# Altium project Speedometer_Tech.PrjPcb (part 2 of 2)

## Sheet 100_PowerSupply.SchDoc
size A3; SheetNumber: 11; SheetTotal: 12
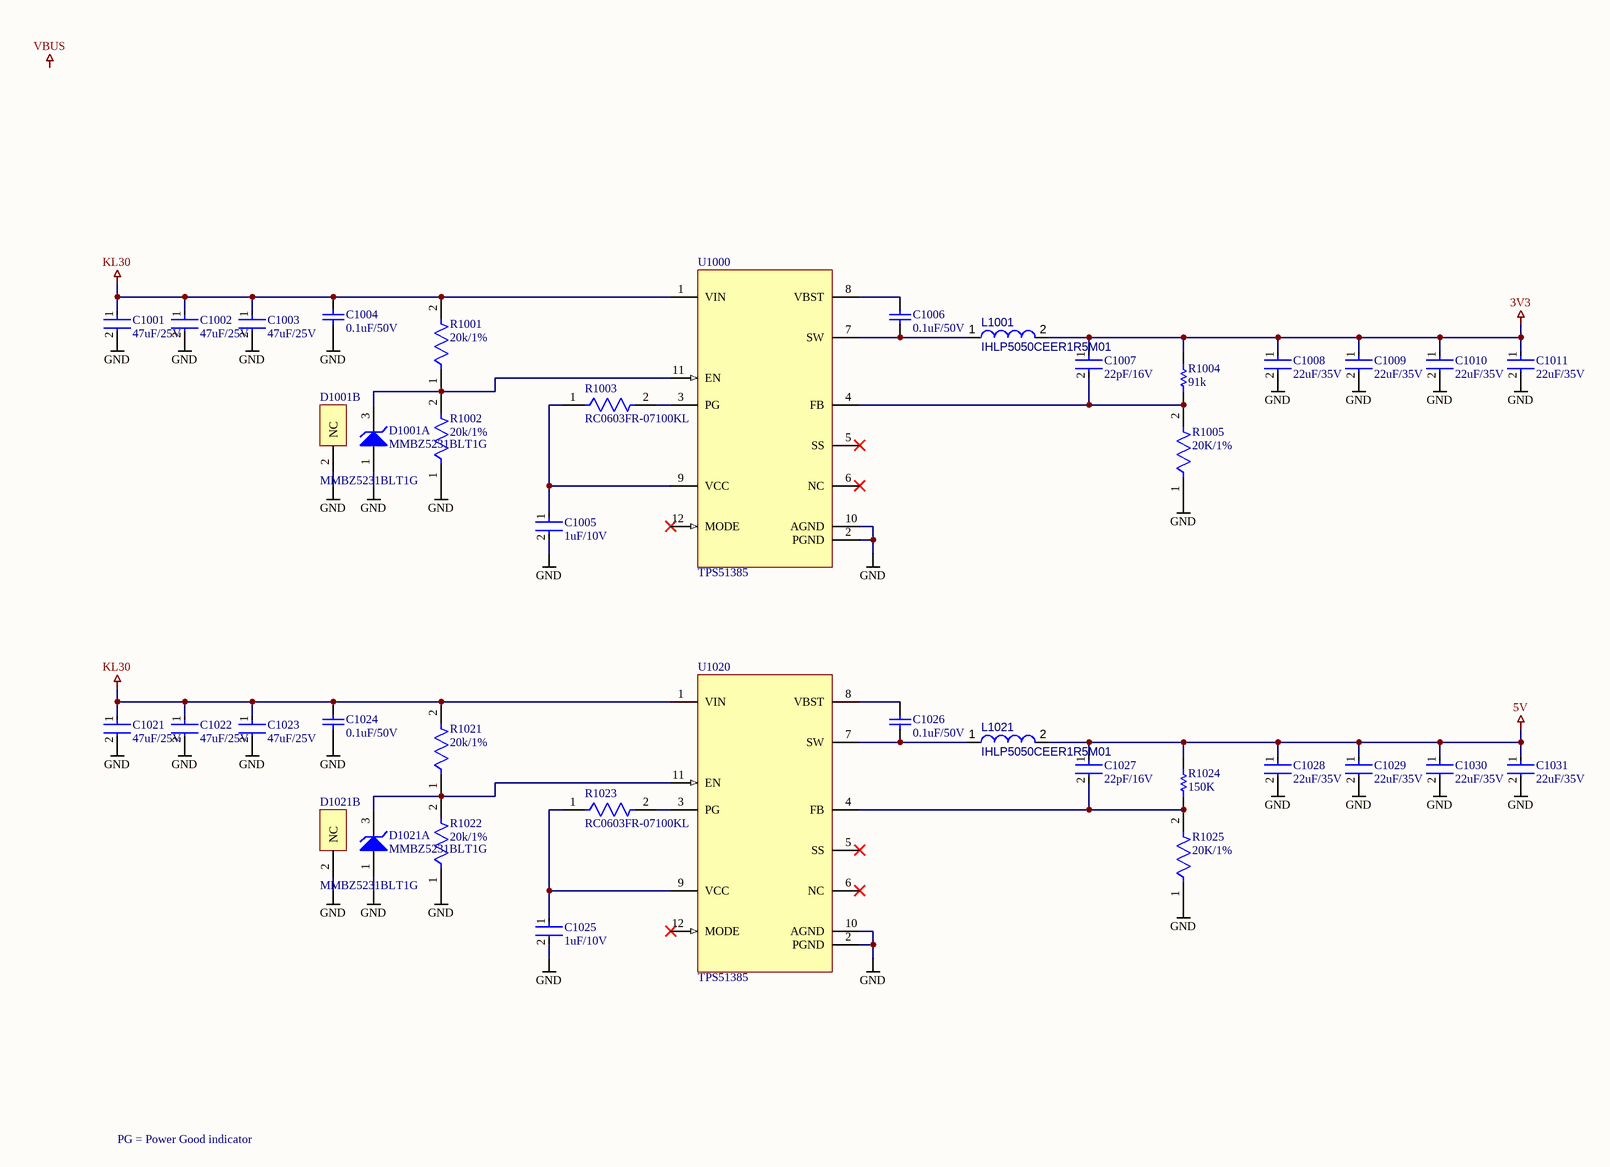
[diagram p10: 100_PowerSupply.SchDoc]

### Parts
C1001  47uF/25V  [FP-C3216-160-0_2-MFG]
C1002  47uF/25V  [FP-C3216-160-0_2-MFG]
C1003  47uF/25V  [FP-C3216-160-0_2-MFG]
C1004  0.1uF/50V  [CAPC2013X135X45ML10T25]
C1005  1uF/10V  [FP-C0603-CG-MFG]
C1006  0.1uF/50V  [CAPC2013X135X45ML10T25]
C1007  22pF/16V  [FP-C0603C-CF-MFG]
C1008  22uF/35V  [FP-C3216-160-0_2-IPC_B]
C1009  22uF/35V  [FP-C3216-160-0_2-IPC_B]
C1010  22uF/35V  [FP-C3216-160-0_2-IPC_B]
C1011  22uF/35V  [FP-C3216-160-0_2-IPC_B]
C1021  47uF/25V  [FP-C3216-160-0_2-MFG]
C1022  47uF/25V  [FP-C3216-160-0_2-MFG]
C1023  47uF/25V  [FP-C3216-160-0_2-MFG]
C1024  0.1uF/50V  [CAPC2013X135X45ML10T25]
C1025  1uF/10V  [FP-C0603-CG-MFG]
C1026  0.1uF/50V  [CAPC2013X135X45ML10T25]
C1027  22pF/16V  [FP-C0603C-CF-MFG]
C1028  22uF/35V  [FP-C3216-160-0_2-IPC_B]
C1029  22uF/35V  [FP-C3216-160-0_2-IPC_B]
C1030  22uF/35V  [FP-C3216-160-0_2-IPC_B]
C1031  22uF/35V  [FP-C3216-160-0_2-IPC_B]
D1001  MMBZ5231BLT1G  [ONSC-SOT-23-3-318-08_V]  (parts A,B of 2)
D1021  MMBZ5231BLT1G  [ONSC-SOT-23-3-318-08_V]  (parts A,B of 2)
L1001  IHLP5050CEER1R5M01  [IHLP5050CEER1R5M01]
L1021  IHLP5050CEER1R5M01  [IHLP5050CEER1R5M01]
R1001  20k/1%  [FP-RC0603-0_55-IPC_C]
R1002  20k/1%  [FP-RC0603-0_55-IPC_C]
R1003  RC0603FR-07100KL  [FP-RC0603-0_55-MFG]
R1004  91k  [RESC1609X50X30NL10T20]
R1005  20K/1%  [FP-RC0603-0_55-IPC_C]
R1021  20k/1%  [FP-RC0603-0_55-IPC_C]
R1022  20k/1%  [FP-RC0603-0_55-IPC_C]
R1023  RC0603FR-07100KL  [FP-RC0603-0_55-MFG]
R1024  150K  [RESC1608X55X30NL15T15]
R1025  20K/1%  [FP-RC0603-0_55-IPC_C]
U1000  TPS51385  [TPS51386]
U1020  TPS51385  [TPS51386]

### Nets
3V3: C1007.1 C1008.1 C1009.1 C1010.1 C1011.1 L1001.2 R1004.2
5V: C1027.1 C1028.1 C1029.1 C1030.1 C1031.1 L1021.2 R1024.2
GND: C1001.2 C1002.2 C1003.2 C1004.1 C1005.2 C1008.2 C1009.2 C1010.2 C1011.2 C1021.2 C1022.2 C1023.2 C1024.1 C1025.2 C1028.2 C1029.2 C1030.2 C1031.2 D1001.1(A) D1001.2(NC) D1021.1(A) D1021.2(NC) R1002.1 R1005.1 R1022.1 R1025.1 U1000.2(PGND) U1000.10(AGND) U1020.2(PGND) U1020.10(AGND)
KL30: C1001.1 C1002.1 C1003.1 C1004.2 C1021.1 C1022.1 C1023.1 C1024.2 R1001.2 R1021.2 U1000.1(VIN) U1020.1(VIN)
NetC1005_1: C1005.1 R1003.1 U1000.9(VCC)
NetC1006_1: C1006.1 L1001.1 U1000.7(SW)
NetC1006_2: C1006.2 U1000.8(VBST)
NetC1007_2: C1007.2 R1004.1 R1005.2 U1000.4(FB)
NetC1025_1: C1025.1 R1023.1 U1020.9(VCC)
NetC1026_1: C1026.1 L1021.1 U1020.7(SW)
NetC1026_2: C1026.2 U1020.8(VBST)
NetC1027_2: C1027.2 R1024.1 R1025.2 U1020.4(FB)
NetD1001_3: D1001.3(K) R1001.1 R1002.2 U1000.11(EN)
NetD1021_3: D1021.3(K) R1021.1 R1022.2 U1020.11(EN)
NetR1003_2: R1003.2 U1000.3(PG)
NetR1023_2: R1023.2 U1020.3(PG)

Not connected (* = marked no-connect by the designer): U1000 5(SS)* 6(NC)* 12(MODE)*; U1020 5(SS)* 6(NC)* 12(MODE)*

### Notes on the sheet
- PG = Power Good indicator
- Labels drawn without touching a wire or pin: VBUS

### Library data of the parts
C1001-C1003 C1021-C1023 = CMP-2000-05397-3: Multilayer Ceramic Capacitors 47uF ±20% 25V X5R SMD 1206 / C3216X5R1E476M160AC; Weight: 0.000571oz; Dielectric: X5R; Length: 0.126inch; Voltage Rating: 25V; Case/Package: 1206; Dielectric Material: Ceramic; Min Operating Temperature: -55°C; Lead Free: Lead Free; Packaging: Tape and Reel; Package Quantity: 1; Mount: Surface Mount; Depth: 1.6mm; REACH SVHC: No SVHC; Termination: SMD/SMT; Case Code (Imperial): 1206; Series: C; Resistor Type: Ceramic; Voltage: 25V; Width: 0.063inch; Height: 1.6mm; Tolerance: 20%; Capacitance: 47uF; Max Operating Temperature: 85°C; Voltage Rating (DC): 25V; RoHS Compliant: Yes; Thickness: 0.071inch; Case Code (Metric): 3216
C1004 C1006 C1024 C1026 = CMP-2100-03644-1: Chip Capacitor, 0.1 uF, +/- 10%, 50 V, -55 to 125 degC, 0805 (2012 Metric), RoHS, Tape and Reel / GRM21BR71H104KA01L; Manufacturer: Murata; Voltage: 50V; Capacitance: 100nF; Insulation Resistance: 10GR; Dielectric Material: Ceramic; Dielectric: X7R; Package Description: 2-Pin Surface Mount Device, Body 2 x 1.25 mm; Manufacturer URL: http://www.murata.com/; Case Code (Imperial): 0805; Datasheet URL: http://psearch.en.murata.com/capacitor/product/GRM21BR71H104KA01%23.pdf; Termination: SMD/SMT; Lead Free: LeadFree; Package Quantity: 1; Mount: SurfaceMount; REACH SVHC: Unknown; Thickness: 0.053inch; Height: 1.25mm; Case/Package: 0805; Voltage Rating: 50V; Width: 0.049inch; Case Code (Metric): 2012; Material: Ceramic; Min Operating Temperature: -55degC; RoHSCompliant: true; Datasheet Version: 42675.0; Voltage Rating (DC): 50V; Tolerance: 10%; Package Reference: 0805; Depth: 1.25mm; Length: 2mm; Max Operating Temperature: 125degC; Packaging: TapeandReel; Number of Pins: 2; Radiation Hardening: No
C1005 C1025 = CMP-2006-02243-2: CAP CER 1UF 10V Y5V 0603 / C0603C105Z8VACTU; Dielectric Material: Ceramic; Tolerance: 80%; Dissipation Factor: 10%; Case/Package: 0603; Width: 0.8mm; Radiation Hardening: No; Lead Pitch: 0.7mm; Termination: SMD/SMT; Min Operating Temperature: -30°C; Voltage Rating (DC): 10V; Length: 1.6mm; Packaging: Tape and Reel; Mount: Surface Mount; REACH SVHC: No SVHC; Series: C; Case Code (Imperial): 0603; Package Quantity: 1; Thickness: 0.035inch; Capacitance: 1uF; Height: 0.8mm; Dielectric: Y5V; Construction: Flat; Lead Free: Lead Free; Case Code (Metric): 1608; Max Operating Temperature: 85°C; Voltage Rating: 10V; Depth: 0.8mm; RoHS Compliant: Yes
C1007 C1027 = CMP-2006-03465-2: CAP CER 22PF 16V 10% NP0 0603 / C0603C220K4GACTU; Manufacturer: KEMET; Temperature Characteristic: C0G; Temperature Coefficient: 30ppm/°C; Tolerance: 0.1; Material: Ceramic; Automotive Grade: Grade 1; Description: C0603 22 pF C0G 30ppm/°C 10.00% 16 V; ComponentLink2URL: https://api.kemet.com/component-edge/download/datasheet/C0603C100J5GACAUTO.pdf; Mouser Description: Multilayer Ceramic Capacitors MLCC - SMD/SMT 16volts 22pF C0G 10%; Package: C0603C-CF; Height: 0.87mm; Device Class L1: Passive Components; ComponentLink2Description: Datasheet; Device Class L3: Ceramic Capacitors; Device Class L2: Capacitors; Value: 22 pF; Temperature Range High: +125°C; Automotive: Yes; Digikey Description: CAP CER 22PF 16V 10% NP0 0603; Category: Cap; Capacitance: 22 pF; Manufacturer Part Number: C0603C220K4GACTU; RoHS: TRUE; Octopart: https://octopart.com/c0603c220k4gactu-kemet-17097913; Temperature: -55°C to +125°C; Lead Free: Yes; Temperature Range Low: -55°C; Voltage Rating: 16 V
C1008-C1011 C1028-C1031 = CMP-2000-05398-2: Multilayer Ceramic Capacitors 22uF ±20% 35V X5R SMD 1206 / C3216X5R1V226M160AC; Mount: Surface Mount; Voltage Rating: 35V; Length: 3.2mm; Case/Package: 1206; Width: 0.063inch; Dielectric Material: Ceramic; Series: C; Voltage Rating (DC): 35V; Construction: Flat; Tolerance: 20%; Dielectric: X5R; Voltage: 35V; Min Operating Temperature: -55°C; Case Code (Metric): 3216; Termination: SMD/SMT; Capacitance: 22uF; Resistor Type: Ceramic; RoHS Compliant: Yes; Height: 1.6mm; Depth: 1.6mm; Radiation Hardening: No; Package Quantity: 2000; REACH SVHC: No SVHC; Case Code (Imperial): 1206; Weight: 0.000571oz; Max Operating Temperature: 85°C; Packaging: Tape and Reel; Thickness: 1.6mm; Lead Free: Lead Free
D1001 D1021 = CMP-1060-00985-1: Zener Voltage Regulator, 225 mW, 3-Pin SOT-23, Pb-Free, Tape and Reel; Manufacturer: On Semiconductor; VZ Typ (V): 5.1; Packing: Tape and Reel; ComponentLink1Description: Manufacturer URL; PartNumber: MMBZ5231BLT1G; PackageReference: SOT-23-3-318-08; ComponentLink1URL: http://www.onsemi.com/; ComponentLink3URL: http://www.onsemi.cn/pub_link/Collateral/318-08.PDF; Mounting Technology: Surface Mount; ComponentLink2Description: Datasheet; DatasheetVersion: Rev. 12; ComponentLink3Description: Package Specification; PackageVersion: Rev. AP, 11/2009; ComponentLink2URL: http://www.onsemi.cn/pub_link/Collateral/MMBZ5221BLT1-D.PDF; RoHS: Pb-Free; PackageDescription: 3-Pin Small Outline Transistor, Body 2.92 x 1.3 mm, Pitch 0.95 mm
L1001 L1021 = IHLP5050CEER1R5M01: Chip Inductor, 1.5 uH, +/- 20% / IHLP5050CEER1R5M01
R1001 R1002 R1005 R1021 R1022 R1025 = CMP-2000-06932-2: RES 20K OHM 1% 1/10W 0603 / RC0603FR-0720KL; Voltage Rating: 50V; Temperature Coefficient: 100ppm/°C; Power Rating: 100mW; Resistance: 20kR; Height: 0.022inch; REACH SVHC: No SVHC; Case Code (Metric): 1608; Depth: 0.8mm; Tolerance: 1%; Min Operating Temperature: -55°C; Series: RC; RoHS Compliant: Yes; Resistor Type: Thick Film; Max Power Dissipation: 100mW; Features: Moisture Resistant; Max Operating Temperature: 155°C; Package Quantity: 1; Size Code: 0603; Packaging: Tape and Reel; Width: 0.031inch; Length: 0.063inch; Military Standard: Not; Technology: THICK FILM; Number of Terminations: 2; Termination: SMD/SMT; Construction: Rectangular; Case/Package: 0603; Number of Pins: 2; Lead Free: Lead Free; Voltage Rating (DC): 50V; Resistance Tolerance: 1%; Case Code (Imperial): 0603
R1003 R1023 = CMP-2100-03662-2: RES SMD 100K OHM 1% 1/10W 0603; Voltage Rating (DC): 50V; Resistance: 100kR; Max Power Dissipation: 100mW; Temperature Coefficient: 100ppm/°C; Working Voltage: 75V; Length: 1.6mm; Lead Free: Lead Free; Number of Terminations: 2; Packaging: Tape and Reel; Voltage Rating: 50V; Termination: SMD/SMT; Width: 0.8mm; Resistor Type: Thick Film; Resistance Tolerance: 1%; Features: Moisture Resistant; Height: 0.45mm; Construction: Rectangular; Case/Package: 0603; Military Standard: Not; Case Code (Imperial): 0603; Series: RC; Technology: THICK FILM; Depth: 0.8mm; RoHS Compliant: Yes; REACH SVHC: No SVHC; Min Operating Temperature: -55°C; Case Code (Metric): 1608; Max Operating Temperature: 155°C; Power Rating: 100mW; Number of Pins: 2; Tolerance: 1%
R1004 = CMP-2000-03640-1: CRCW060391K0FKEA; Manufacturer: Vishay Dale; Part Number: CRCW060391K0FKEA
R1024 = CMP-1012-00754-2: ERJ-3EKF1503V; Manufacturer: Panasonic; Part Number: ERJ-3EKF1503V
U1000 U1020 = TPS51386: 8A Synchronous Buck Converter - TPS51386

## Sheet 90_CAN.SchDoc
size A4; SheetNumber: 10; SheetTotal: 12
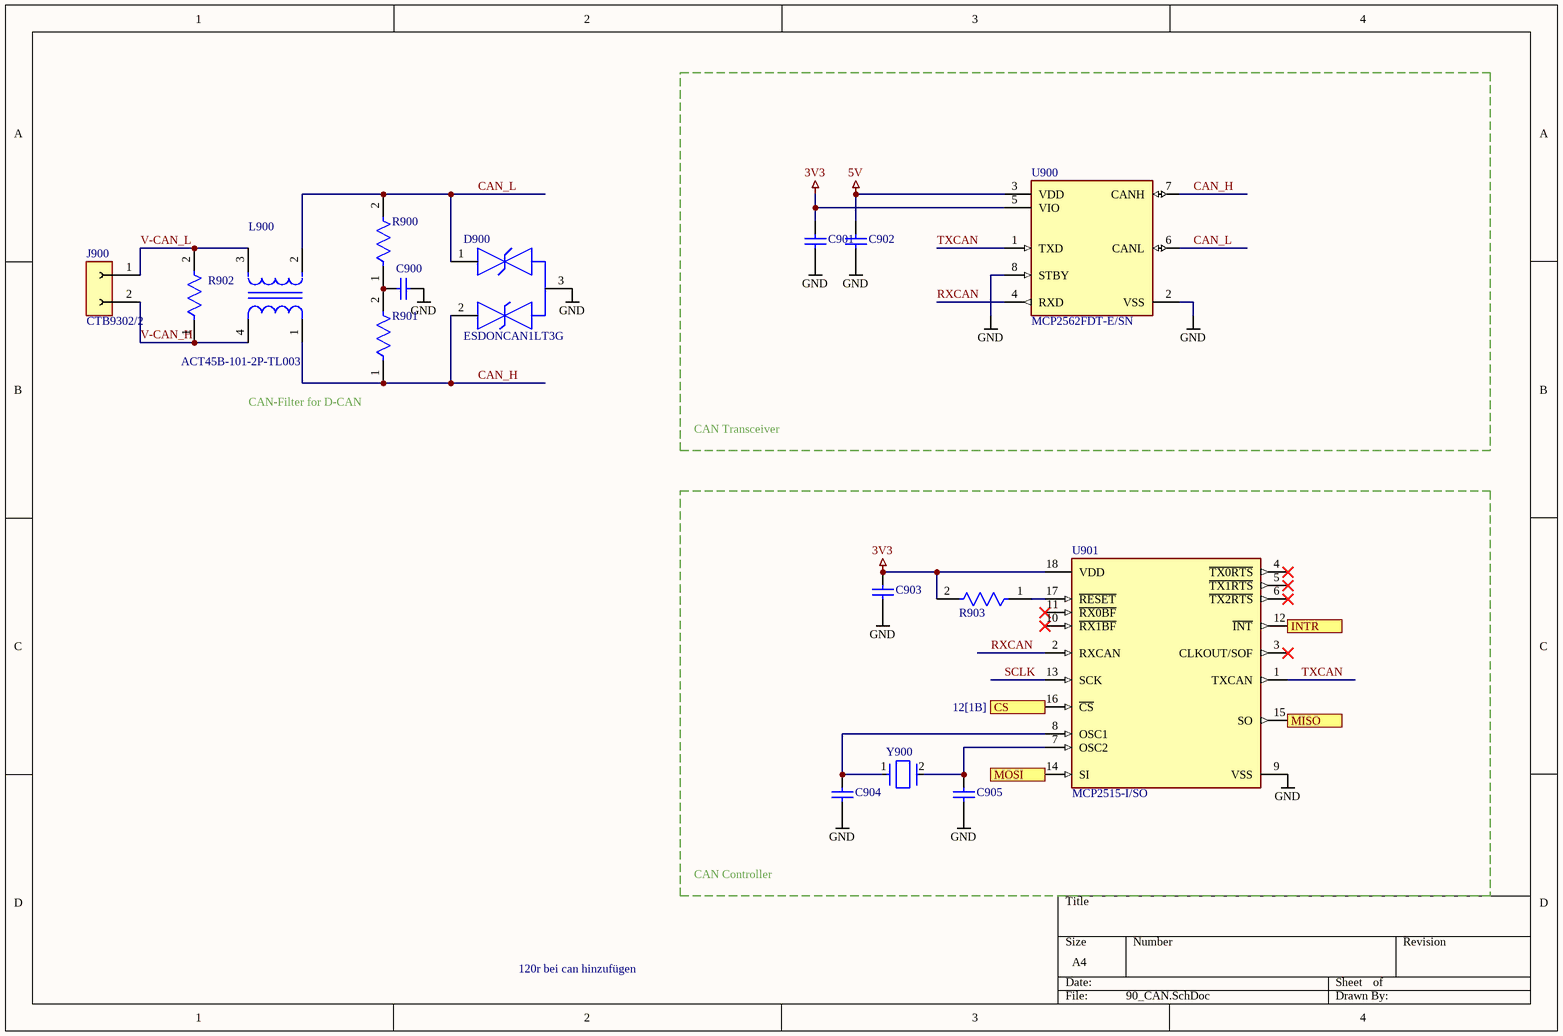
[diagram p11: 90_CAN.SchDoc]

### Parts
C900  GRM188R71H472KA01D  [CAPC1608X90X35ML10T15]  (value not drawn)
C901  GRM188R71H104KA93D  [CAPC1608X90X35ML10T15]  (value not drawn)
C902  GRM188R71H104KA93D  [CAPC1608X90X35ML10T15]  (value not drawn)
C903  GRM188R71H104KA93D  [CAPC1608X90X35ML10T15]  (value not drawn)
C904  GRM1885C1H220JA01D  [CAPC1608X90X35ML10T15]  (value not drawn)
C905  GRM1885C1H220JA01D  [CAPC1608X90X35ML10T15]  (value not drawn)
D900  ESDONCAN1LT3G  [FP-318-MFG]
J900  CTB9302/2  [CTB9302-2]
L900  ACT45B-101-2P-TL003  [FP-ACT45B-MFG]
R900  CRCW06034K70FKEA  [FP-CRCW0603-e3-IPC_A]  (value not drawn)
R901  CRCW06034K70FKEA  [FP-CRCW0603-e3-IPC_A]  (value not drawn)
R902  CRCW0603120RFKEA  [FP-CRCW0603-e3-MFG]  (value not drawn)
R903  CRCW06034K70FKEA  [FP-CRCW0603-e3-IPC_A]  (value not drawn)
U900  MCP2562FDT-E/SN  [FP-C04-057-SN-MFG]
U901  MCP2515-I/SO  [FP-C04-051-MFG]
Y900  ABLS-16.000MHZ-K4T  [FP-ABLS-MFG]  (value not drawn)

### Blocks framed on the sheet
CAN Transceiver: C901 C902 U900
CAN Controller: C903-C905 R903 U901 Y900

### Ports
CS (in, see 12[1B]), INTR, MISO, MOSI

### Nets
3V3: C901.2 C903.2 R903.2 U900.5(VIO) U901.18(VDD)
5V: C902.2 U900.3(VDD)
GND: C900.2 C901.1 C902.1 C903.1 C904.1 C905.1 D900.3 U900.2(VSS) U900.8(STBY) U901.9(VSS)
CAN_H: D900.2 L900.1 R901.1 U900.7(CANH)
CAN_L: D900.1 L900.2 R900.2 U900.6(CANL)
CS: U901.16(~{CS}) ; port CS
MISO: U901.15(SO) ; port MISO
MOSI: U901.14(SI) ; port MOSI
RXCAN: U900.4(RXD) U901.2(RXCAN)
SCLK: U901.13(SCK)
TXCAN: U900.1(TXD) U901.1(TXCAN)
V-CAN_H: J900.2 L900.4 R902.1
V-CAN_L: J900.1 L900.3 R902.2
NetC900_1: C900.1 R900.1 R901.2
NetC904_2: C904.2 U901.8(OSC1) Y900.1
NetC905_2: C905.2 U901.7(OSC2) Y900.2
NetR903_1: R903.1 U901.17(~{RESET})
NetU901_12: U901.12(~{INT}) ; port INTR

Not connected (* = marked no-connect by the designer): U901 3(CLKOUT/SOF)* 4(~{TX0RTS})* 5(~{TX1RTS})* 6(~{TX2RTS})* 10(~{RX1BF})* 11(~{RX0BF})*

### Notes on the sheet
- (near R901) CAN-Filter for D-CAN
- 120r bei can hinzufügen

### Library data of the parts
C900 = CMP-2006-02924-1: Manufacturer: Murata; Part Number: GRM188R71H472KA01D
C901-C903 = CMP-2100-03643-1: Chip Capacitor, 0.1 uF, +/- 10%, 50 V, -55 to 125 degC, 0603 (1608 Metric), RoHS, Tape and Reel; Manufacturer: Murata; Dielectric Material: Ceramic; Voltage Rating: 50V; Capacitance: 100nF; Dielectric: X7R; Insulation Resistance: 10GR; Case Code (Metric): 1608; Lead Free: LeadFree; Depth: 0.8mm; Number of Pins: 2; Radiation Hardening: No; Case/Package: 0603; Manufacturer URL: http://www.murata.com/; Packaging: TapeandReel; Length: 1.6mm; Contact Plating: Tin; Datasheet URL: http://psearch.en.murata.com/capacitor/product/GRM188R71H104KA93%23.pdf; Tolerance: 10%; Case Code (Imperial): 0603; Min Operating Temperature: -55degC; RoHSCompliant: true; Voltage: 50V; Termination: SMD/SMT; Mount: SurfaceMount; Material: Ceramic; Package Quantity: 1; Height: 0.8mm; Thickness: 0.035inch; REACH SVHC: NoSVHC; Max Operating Temperature: 125degC; Width: 0.8mm; Package Reference: 0603; Voltage Rating (DC): 50V; Datasheet Version: 42675.0; Package Description: 2-Pin Surface Mount Device, Body 1.6 x 0.8 mm
C904 C905 = CMP-2000-04945-1: Chip Capacitor, 22 pF, +/- 5%, 50 V, -55 to 125 degC, 0603 (1608 Metric), RoHS, Tape and Reel; Manufacturer: Murata; Capacitance: 22pF; Rated Voltage: 50V; Dielectric: C0G; Manufacturer URL: http://www.murata.com/; Datasheet Version: Jul-06; Package Reference: 603; Tolerance (%): ±5%; Case Size/Dimension: 0603; Package Description: 2-Pin Surface Mount Device, Body 1.6 x 0.8 mm; Datasheet URL: https://datasheet.ciiva.com/11786/0900766b807a1cab-11786398.pdf
D900 = CMP-00278-29932846-1: ESDONCAN1LT3G ESD Suppressor TVS Dual Bi-Dir 3-Pin SOT-23 T/R - Tape and Reel; Manufacturer Lifecycle Status: ACTIVE; Number of Bidirectional Channels: 2; Power Line Protection: No; Peak Pulse Current: 3A; Reverse Standoff Voltage: 24V; Min Breakdown Voltage: 26.2V; Clamping Voltage: 50V; Number of Pins: 3; RoHS: Compliant; Mount: Surface Mount; Packaging: Tape & Reel (TR); Min Operating Temperature: -55°C; Lifecycle Status: Production; Max Operating Temperature: 150°C; Composition: Zener; NexarPartId: 29932846; Case/Package: TO-236-3; Lead Free: Lead Free
J900 = CTB9302-2: CTB9302/2 - Stiftleiste - 2-pol, RM 5 mm, 0°
L900 = CMP-08256-000007-1: CMC 100UH 150MA 2LN SMD AEC-Q200; Manufacturer: TDK; Tolerance: +50/-30%; Rms Current: 0.15A; Automotive Grade: Grade 0; Series Resistance: 2Ω; Test Frequency: 100kHz; Impedance At Frequency: 5800Ω @ 10MHz; ComponentLink2URL: https://product.tdk.com/info/en/catalog/datasheets/cmf_automotive_signal_act45b_en.pdf; Octopart: https://octopart.com/act45b-101-2p-tl003-tdk-11353565; Lead Free: Yes; Manufacturer Part Number: ACT45B-101-2P-TL003; Mouser Description: Common Mode Chokes / Filters 5000ohms 100uH 150mA CAN-BUS AEC-Q200; Device Class L1: Passive Components; Automotive: Yes; Temperature Range High: +150°C; Device Class L2: EMI / RFI Components; ComponentLink2Description: Datasheet; Package: ACT45B; Category: Ind; Value: 100uH; RoHS: TRUE; Temperature: -40°C to +150°C; Height: 3mm; Inductance: 100uH; Digikey Description: CMC 100UH 150MA 2LN SMD AEC-Q200; Composition: Wirewound; Device Class L3: Common Mode Chokes; Temperature Range Low: -40°C
R900 R901 R903 = CMP-1666-00019-3: RES Thick Film, 4.7kΩ, 1%, 0.1W, 100ppm/°C, 0603; Resistance: 4.7kR; Voltage Rating: 75V; Power Rating: 100mW; Case Code (Metric): 1608; Military Standard: Not; Packaging: Tape and Reel; Termination: SMD/SMT; Temperature Coefficient: 100ppm/°C; Lead Free: Lead Free; Length: 1.55mm; Width: 0.85mm; Height: 0.45mm; Depth: 0.85mm; Weight: 7.1E-05oz; Case Code (Imperial): 0603; Contact Plating: Tin; Case/Package: 0603; Max Operating Temperature: 155°C; Mount: Surface Mount; Tolerance: 1%; Min Operating Temperature: -55°C; Package Quantity: 5000; Voltage Rating (DC): 75V; Composition: Thick Film
R902 = CMP-1666-00020-3: RES Thick Film, 120Ω, 1%, 0.1W, 100ppm/°C, 0603; Power Rating: 100mW; Working Voltage: 75V; Resistance: 120R; RoHS Compliant: Yes; Lead Free: Lead Free; Termination: SMD/SMT; Radiation Hardening: No; Case Code (Imperial): 0603; Series: CRCW; Resistance Tolerance: 1%; Number of Terminations: 2; Tolerance: 1%; Max Operating Temperature: 155°C; Contact Plating: Tin; Package Quantity: 10; Max Power Dissipation: 100mW; Case Code (Metric): 1608; Weight: 7.1E-05oz; Packaging: Tape and Reel; Mount: Surface Mount; Military Standard: Not; Construction: Rectangular; Features: Automotive AEC-Q200; Depth: 0.85mm; Min Operating Temperature: -55°C; Case/Package: 0603; Height: 0.45mm; Voltage Rating (DC): 75V; Width: 0.033inch; Technology: THICK FILM; Length: 1.55mm; Voltage Rating: 75V; Temperature Coefficient: 100ppm/°C; Resistor Type: Thick Film
U900 = CMP-06279-000005-1: IC TRANSCEIVER 1/1 8SOIC; Operating Supply Current: 70mA; Data Rate: 8Mbps; Number of Transceivers: 1; Receiver Hysteresis: 200mV; Max Supply Voltage: 5.5V; Min Supply Voltage: 4.5V; Weight: 0.019048oz; Package Quantity: 3300; Case/Package: SOIC; Mount: Surface Mount; Max Operating Temperature: 125°C; Min Operating Temperature: -40°C; Packaging: Tape and Reel; Number of Pins: 8
U901 = CMP-0186-00133-3: IC CAN CONTROLLER W/SPI 18SOIC; Manufacturer: Microchip; Min Supply Voltage: 2.7V; Max Supply Voltage: 5.5V; Standoff Height: 0.1mm; Nominal Supply Current: 10mA; Interface: SPI,CAN; Lead Free: Yes; Digikey Description: IC CAN CONTROLLER W/SPI 18SOIC; Category: IC; RoHS: TRUE; Manufacturer Part Number: MCP2515-I/SO; ComponentLink2URL: http://ww1.microchip.com/downloads/en/DeviceDoc/MCP2515-Stand-Alone-CAN-Controller-with-SPI-20001801J.pdf; Mouser Description: CAN Interface IC W/ SPI Interface; Device Class L2: Interface ICs; Package: C04-051; Automotive: No; Function: Controller; Octopart: https://octopart.com/mcp2515-i%2Fso-microchip-430187; Temperature: -40°C to +85°C; Ipc Land Pattern Name: SOIC127P1030X265-18; Ambient Temperature Range Low: -65°C; Height: 2.65mm; Device Class L1: Integrated Circuits (ICs); Ambient Temperature Range High: +125°C; Footprint Url: http://ww1.microchip.com/downloads/en/DeviceDoc/18L_SOIC_Wide_7.50_SO_C04-0051D.pdf; Temperature Range Low: -40°C; Device Class L3: Controllers; Temperature Range High: +85°C; ComponentLink2Description: Datasheet
Y900 = CMP-27762-000003-1: CRYSTAL 16.0000MHZ 18PF SMD; Manufacturer: Abracon; Frequency: 16MHz; Stability: 50ppm; Tolerance: 30ppm; Standoff Height: 0mm; Esr: 40Ω; ComponentLink2URL: https://abracon.com/Resonators/abls.pdf; Temperature Range High: +125°C; Package: ABLS; Device Class L3: Crystals; Temperature: -40°C to +125°C; Load Capacitance: 18pF; Device Class L2: Crystals / Oscillators; Mouser Description: Crystal 16MHz ±30ppm (Tol) ±50ppm (Stability) 18pF FUND 40Ohm 2-Pin HC-49/US SMD T/R; Category: Crys; ComponentLink2Description: Datasheet; Manufacturer Part Number: ABLS-16.000MHZ-K4T; Series: ABLS; Automotive: No; Octopart: https://octopart.com/abls-16.000mhz-k4t-abracon-18618626; RoHS: TRUE; Digikey Description: CRYSTAL 16.0000MHZ 18PF SMD; Temperature Range Low: -40°C; Lead Free: Yes; Height: 4.3mm; Device Class L1: Passive Components

## Nets that join several sheets
3V3: 110_ESP32s3 (6 pins), 60_Inkremental (S600.3 S600.4), 80_SignalInput (8 pins), 100_PowerSupply (7 pins), 90_CAN (5 pins)
5V: 00_Overview (P001.3), 110_ESP32s3 (5 pins), 20_Torq (20 pins), 10_Speed (24 pins), 30_SOC (17 pins), 40_Temp (18 pins), 70_Signalleuchten (13 pins), 50_Distance (35 pins), 100_PowerSupply (7 pins), 90_CAN (C902.2 U900.3)
GND: 00_Overview (5 pins), 110_ESP32s3 (33 pins), 20_Torq (20 pins), 10_Speed (29 pins), 30_SOC (17 pins), 40_Temp (18 pins), 70_Signalleuchten (13 pins), 50_Distance (65 pins), 60_Inkremental (R600.1), 80_SignalInput (8 pins), 100_PowerSupply (30 pins), 90_CAN (10 pins)
KL30: 00_Overview (R004.1 R005.1 R006.1 R007.1), 80_SignalInput (21 pins), 100_PowerSupply (12 pins)
KL30i: 00_Overview (R004.2 R005.2 R006.2 R007.2), 110_ESP32s3 (D1101.1 D1102.1)
KL31: 00_Overview (R000.1 R001.1 R002.1 R003.1), 80_SignalInput (J800.2)
CS: 110_ESP32s3 (U1100.7), 90_CAN (U901.16)
~{DIG-RST}: 110_ESP32s3 (Q1103.3 R1103.1 S1103.3 S1103.4), 10_Speed (5 pins), 50_Distance (10 pins)
MISO: 110_ESP32s3 (U1100.5), 90_CAN (U901.15)
MOSI: 110_ESP32s3 (U1100.6), 90_CAN (U901.14)
NetP001_2: 00_Overview (P001.2), 40_Temp (U420.3)
NetQ1104_3: 110_ESP32s3 (Q1104.3 R1104.1 S1104.3 S1104.4), 80_SignalInput (U840.18)
NetR600_2: 110_ESP32s3 (U1100.21), 60_Inkremental (R600.2 S600.1 S600.2)
NetU400_1: 40_Temp (U400.1), 70_Signalleuchten (U712.3)
NetU901_12: 110_ESP32s3 (U1100.12), 90_CAN (U901.12)
SCL: 110_ESP32s3 (P1103.5 U1100.38), 10_Speed (5 pins), 50_Distance (10 pins), 80_SignalInput (U840.12)
SDA: 110_ESP32s3 (P1103.3 U1100.39), 10_Speed (5 pins), 50_Distance (10 pins), 80_SignalInput (U840.13)